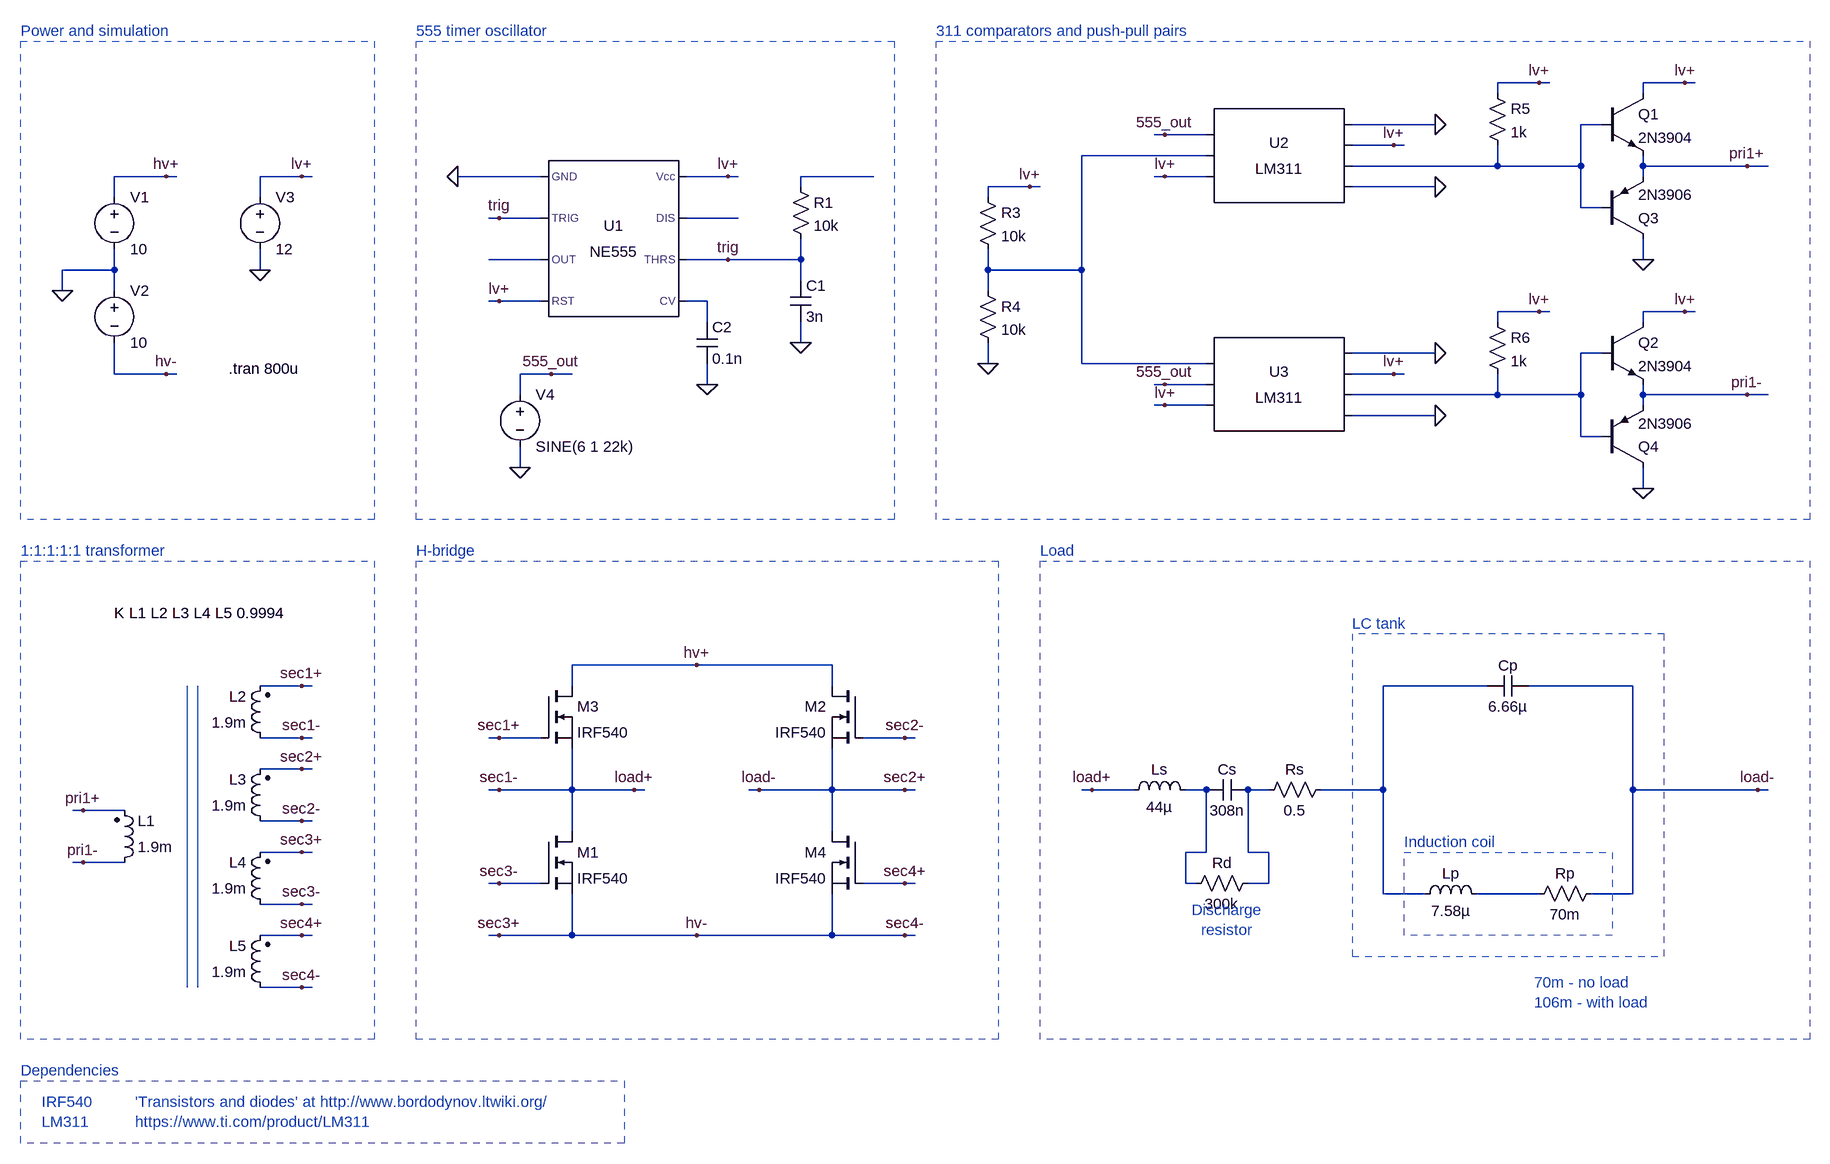
[diagram p0: schematic heater.asc]
heater.asc, the LTspice schematic file:
Version 4
SHEET 1 1956 1544
WIRE 928 -160 864 -160
WIRE 944 -160 928 -160
WIRE 1152 -160 1088 -160
WIRE 1168 -160 1152 -160
WIRE 864 -144 864 -160
WIRE 1088 -144 1088 -160
WIRE 768 -96 640 -96
WIRE 1024 -96 992 -96
WIRE 352 -80 336 -80
WIRE 416 -80 352 -80
WIRE 704 -64 640 -64
WIRE 720 -64 704 -64
WIRE 416 -48 224 -48
WIRE 864 -32 864 -64
WIRE 864 -32 640 -32
WIRE 992 -32 992 -96
WIRE 992 -32 864 -32
WIRE 1088 -32 1088 -48
WIRE 1248 -32 1088 -32
WIRE 1280 -32 1248 -32
WIRE -1184 -16 -1264 -16
WIRE -1168 -16 -1184 -16
WIRE -976 -16 -1040 -16
WIRE -960 -16 -976 -16
WIRE -608 -16 -736 -16
WIRE -320 -16 -384 -16
WIRE -304 -16 -320 -16
WIRE -96 -16 -208 -16
WIRE 352 -16 336 -16
WIRE 416 -16 352 -16
WIRE 1088 -16 1088 -32
WIRE -208 0 -208 -16
WIRE 144 0 80 0
WIRE 160 0 144 0
WIRE 768 0 640 0
WIRE -1264 16 -1264 -16
WIRE -1040 16 -1040 -16
WIRE 80 16 80 0
WIRE 992 32 992 -32
WIRE 1024 32 992 32
WIRE -672 48 -688 48
WIRE -608 48 -672 48
WIRE -304 48 -384 48
WIRE -608 112 -688 112
WIRE -320 112 -384 112
WIRE -208 112 -208 80
WIRE -208 112 -320 112
WIRE 1088 112 1088 80
WIRE -1264 128 -1264 96
WIRE -1264 128 -1344 128
WIRE -1040 128 -1040 96
WIRE 80 128 80 96
WIRE 224 128 224 -48
WIRE 224 128 80 128
WIRE -208 144 -208 112
WIRE -1344 160 -1344 128
WIRE -1264 160 -1264 128
WIRE 80 160 80 128
WIRE -672 176 -688 176
WIRE -608 176 -672 176
WIRE -352 176 -384 176
WIRE 928 192 864 192
WIRE 944 192 928 192
WIRE 1152 192 1088 192
WIRE 1168 192 1152 192
WIRE -352 208 -352 176
WIRE 864 208 864 192
WIRE 1088 208 1088 192
WIRE -208 240 -208 208
WIRE 768 256 640 256
WIRE 1024 256 992 256
WIRE 80 272 80 240
WIRE 224 272 224 128
WIRE 416 272 224 272
WIRE -1264 288 -1264 240
WIRE -1184 288 -1264 288
WIRE -1168 288 -1184 288
WIRE -592 288 -640 288
WIRE -560 288 -592 288
WIRE 704 288 640 288
WIRE 720 288 704 288
WIRE -352 304 -352 272
WIRE 352 304 336 304
WIRE 416 304 352 304
WIRE -640 320 -640 288
WIRE 864 320 864 288
WIRE 864 320 640 320
WIRE 992 320 992 256
WIRE 992 320 864 320
WIRE 1088 320 1088 304
WIRE 1248 320 1088 320
WIRE 1280 320 1248 320
WIRE 352 336 336 336
WIRE 416 336 352 336
WIRE 1088 336 1088 320
WIRE 768 352 640 352
WIRE 992 384 992 320
WIRE 1024 384 992 384
WIRE -640 432 -640 400
WIRE 1088 464 1088 432
WIRE -368 736 -560 736
WIRE -160 736 -368 736
WIRE -976 768 -1040 768
WIRE -960 768 -976 768
WIRE -560 768 -560 736
WIRE -160 768 -160 736
WIRE 848 768 688 768
WIRE 1072 768 912 768
WIRE -976 848 -1040 848
WIRE -960 848 -976 848
WIRE -672 848 -688 848
WIRE -608 848 -672 848
WIRE -48 848 -112 848
WIRE -32 848 -48 848
WIRE -976 896 -1040 896
WIRE -960 896 -976 896
WIRE -672 928 -688 928
WIRE -560 928 -560 864
WIRE -560 928 -672 928
WIRE -464 928 -560 928
WIRE -448 928 -464 928
WIRE -272 928 -288 928
WIRE -160 928 -160 864
WIRE -160 928 -272 928
WIRE -48 928 -160 928
WIRE -32 928 -48 928
WIRE 240 928 224 928
WIRE 304 928 240 928
WIRE 416 928 384 928
WIRE 512 928 480 928
WIRE 688 928 688 768
WIRE 688 928 592 928
WIRE 1072 928 1072 768
WIRE 1264 928 1072 928
WIRE 1280 928 1264 928
WIRE -1312 960 -1328 960
WIRE -1248 960 -1312 960
WIRE -976 976 -1040 976
WIRE -960 976 -976 976
WIRE -560 992 -560 928
WIRE -160 992 -160 928
WIRE -976 1024 -1040 1024
WIRE -960 1024 -976 1024
WIRE 416 1024 416 928
WIRE 416 1024 384 1024
WIRE 480 1024 480 928
WIRE 512 1024 480 1024
WIRE -1312 1040 -1328 1040
WIRE -1248 1040 -1312 1040
WIRE -672 1072 -688 1072
WIRE -608 1072 -672 1072
WIRE -48 1072 -112 1072
WIRE -32 1072 -48 1072
WIRE 384 1072 384 1024
WIRE 400 1072 384 1072
WIRE 512 1072 512 1024
WIRE 512 1072 480 1072
WIRE 688 1088 688 928
WIRE 752 1088 688 1088
WIRE 928 1088 832 1088
WIRE 1072 1088 1072 928
WIRE 1072 1088 1008 1088
WIRE -976 1104 -1040 1104
WIRE -960 1104 -976 1104
WIRE -976 1152 -1040 1152
WIRE -960 1152 -976 1152
WIRE -672 1152 -688 1152
WIRE -560 1152 -560 1088
WIRE -560 1152 -672 1152
WIRE -368 1152 -560 1152
WIRE -160 1152 -160 1088
WIRE -160 1152 -368 1152
WIRE -48 1152 -160 1152
WIRE -32 1152 -48 1152
WIRE -976 1232 -1040 1232
WIRE -960 1232 -976 1232
FLAG -1344 160 0
FLAG -1184 -16 hv+
FLAG -1184 288 hv-
FLAG -736 -16 0
FLAG -208 240 0
FLAG -320 -16 lv+
FLAG -672 176 lv+
FLAG -320 112 trig
FLAG -672 48 trig
FLAG -1040 128 0
FLAG -976 -16 lv+
FLAG 80 272 0
FLAG 144 0 lv+
FLAG 352 304 555_out
FLAG 1248 -32 pri1+
FLAG 1248 320 pri1-
FLAG 768 0 0
FLAG 768 352 0
FLAG 352 -16 lv+
FLAG 928 -160 lv+
FLAG 928 192 lv+
FLAG 1088 464 0
FLAG 1088 112 0
FLAG 1152 -160 lv+
FLAG 1152 192 lv+
FLAG 352 336 lv+
FLAG -672 848 sec1+
FLAG -672 928 sec1-
FLAG -672 1072 sec3-
FLAG -672 1152 sec3+
FLAG -48 848 sec2-
FLAG -48 928 sec2+
FLAG -48 1072 sec4+
FLAG -48 1152 sec4-
FLAG -976 768 sec1+
FLAG -976 848 sec1-
FLAG -976 896 sec2+
FLAG -976 976 sec2-
FLAG -976 1024 sec3+
FLAG -976 1104 sec3-
FLAG -976 1152 sec4+
FLAG -976 1232 sec4-
FLAG -1312 960 pri1+
FLAG -1312 1040 pri1-
FLAG 768 -96 0
FLAG 768 256 0
FLAG -640 432 0
FLAG -352 304 0
FLAG -592 288 555_out
FLAG 704 -64 lv+
FLAG 704 288 lv+
FLAG -464 928 load+
FLAG -272 928 load-
FLAG -368 736 hv+
FLAG -368 1152 hv-
FLAG 240 928 load+
FLAG 1264 928 load-
FLAG 352 -80 555_out
SYMBOL voltage -1264 0 R0
WINDOW 123 0 0 Left 0
WINDOW 39 0 0 Left 0
SYMATTR InstName V1
SYMATTR Value 10
SYMBOL voltage -1264 144 R0
WINDOW 123 0 0 Left 0
WINDOW 39 0 0 Left 0
SYMATTR InstName V2
SYMATTR Value 10
SYMBOL cap -224 144 R0
SYMATTR InstName C1
SYMATTR Value 3n
SYMBOL voltage -1040 0 R0
WINDOW 123 0 0 Left 0
WINDOW 39 0 0 Left 0
SYMATTR InstName V3
SYMATTR Value 12
SYMBOL AutoGenerated\\LM311 528 -48 R0
SYMATTR InstName U2
SYMBOL res 64 0 R0
SYMATTR InstName R3
SYMATTR Value 10k
SYMBOL res 64 144 R0
SYMATTR InstName R4
SYMATTR Value 10k
SYMBOL res 848 -160 R0
SYMATTR InstName R5
SYMATTR Value 1k
SYMBOL AutoGenerated\\LM311 528 304 R0
SYMATTR InstName U3
SYMBOL res 848 192 R0
SYMATTR InstName R6
SYMATTR Value 1k
SYMBOL npn 1024 -144 R0
SYMATTR InstName Q1
SYMATTR Value 2N3904
SYMBOL npn 1024 208 R0
SYMATTR InstName Q2
SYMATTR Value 2N3904
SYMBOL pnp 1024 80 M180
SYMATTR InstName Q3
SYMATTR Value 2N3906
SYMBOL pnp 1024 432 M180
SYMATTR InstName Q4
SYMATTR Value 2N3906
SYMBOL ind2 -1264 1056 M180
WINDOW 0 36 80 Left 2
WINDOW 3 36 40 Left 2
SYMATTR InstName L1
SYMATTR Value 1.9m
SYMATTR Type ind
SYMBOL ind2 -1024 864 R180
WINDOW 0 36 80 Left 2
WINDOW 3 36 40 Left 2
SYMATTR InstName L2
SYMATTR Value 1.9m
SYMATTR Type ind
SYMBOL ind2 -1024 992 R180
WINDOW 0 36 80 Left 2
WINDOW 3 36 40 Left 2
SYMATTR InstName L3
SYMATTR Value 1.9m
SYMATTR Type ind
SYMBOL ind2 -1024 1120 R180
WINDOW 0 36 80 Left 2
WINDOW 3 36 40 Left 2
SYMATTR InstName L4
SYMATTR Value 1.9m
SYMATTR Type ind
SYMBOL ind2 -1024 1248 R180
WINDOW 0 36 80 Left 2
WINDOW 3 36 40 Left 2
SYMATTR InstName L5
SYMATTR Value 1.9m
SYMATTR Type ind
SYMBOL nmos -608 768 R0
SYMATTR InstName M3
SYMATTR Value IRF540
SYMBOL Misc\\NE555 -496 80 R0
SYMATTR InstName U1
SYMBOL voltage -640 304 R0
WINDOW 123 0 0 Left 0
WINDOW 39 0 0 Left 0
SYMATTR InstName V4
SYMATTR Value SINE(6 1 22k)
SYMBOL res -224 -16 R0
SYMATTR InstName R1
SYMATTR Value 10k
SYMBOL cap -368 208 R0
SYMATTR InstName C2
SYMATTR Value 0.1n
SYMBOL nmos -608 992 R0
SYMATTR InstName M1
SYMATTR Value IRF540
SYMBOL nmos -112 768 M0
SYMATTR InstName M2
SYMATTR Value IRF540
SYMBOL nmos -112 992 M0
SYMATTR InstName M4
SYMATTR Value IRF540
SYMBOL ind 288 944 R270
WINDOW 0 32 56 VTop 2
WINDOW 3 5 56 VBottom 2
SYMATTR InstName Ls
SYMATTR Value 44µ
SYMBOL cap 416 944 R270
WINDOW 0 32 32 VTop 2
WINDOW 3 0 32 VBottom 2
SYMATTR InstName Cs
SYMATTR Value 308n
SYMBOL ind 736 1104 R270
WINDOW 0 32 56 VTop 2
WINDOW 3 5 56 VBottom 2
SYMATTR InstName Lp
SYMATTR Value 7.58µ
SYMBOL res 912 1104 R270
WINDOW 0 32 56 VTop 2
WINDOW 3 0 56 VBottom 2
SYMATTR InstName Rp
SYMATTR Value 70m
SYMBOL cap 848 784 R270
WINDOW 0 32 32 VTop 2
WINDOW 3 0 32 VBottom 2
SYMATTR InstName Cp
SYMATTR Value 6.66µ
SYMBOL res 608 912 R90
WINDOW 0 0 56 VBottom 2
WINDOW 3 32 56 VTop 2
SYMATTR InstName Rs
SYMATTR Value 0.5
SYMBOL res 496 1056 R90
WINDOW 0 0 56 VBottom 2
WINDOW 3 32 56 VTop 2
SYMATTR InstName Rd
SYMATTR Value 300k
TEXT -1088 280 Left 2 !.tran 800u
TEXT -1408 -240 Left 2 ;Power and simulation
TEXT -800 -240 Left 2 ;555 timer oscillator
TEXT 0 -240 Left 2 ;311 comparators and push-pull pairs
TEXT -1408 560 Left 2 ;1:1:1:1:1 transformer
TEXT -800 560 Left 2 ;H-bridge
TEXT -1264 656 Left 2 !K L1 L2 L3 L4 L5 0.9994
TEXT -1232 1408 Left 2 ;'Transistors and diodes' at http://www.bordodynov.ltwiki.org/\nhttps://www.ti.com/product/LM311
TEXT -1408 1360 Left 2 ;Dependencies
TEXT -1376 1408 Left 2 ;IRF540\nLM311
TEXT 160 560 Left 2 ;Load
TEXT 720 1008 Left 2 ;Induction coil
TEXT 640 672 Left 2 ;LC tank
TEXT 448 1128 Center 2 ;Discharge\nresistor
TEXT 920 1224 Left 2 ;70m - no load\n106m - with load
LINE Normal -1136 1232 -1136 768
LINE Normal -1152 1232 -1152 768
RECTANGLE Normal -64 512 -800 -224 2
RECTANGLE Normal -864 512 -1408 -224 2
RECTANGLE Normal 1344 512 0 -224 2
RECTANGLE Normal -480 1472 -1408 1376 2
RECTANGLE Normal 1120 688 640 1184 2
RECTANGLE Normal 1040 1152 720 1024 2
RECTANGLE Normal -864 1312 -1408 576 2
RECTANGLE Normal 96 1312 -800 576 2
RECTANGLE Normal 1344 1312 160 576 2

The netlist it stands for:
* heater.asc
V1 hv+ 0 10
V2 0 sec4- 10
C1 trig 0 3n
V3 lv+ 0 12
* U2: LM311 (symbol AutoGenerated\LM311 not available, pins judged from their places): pin1=555_out pin2=N002 pin3=lv+ pin4=0 pin5=lv+ pin6=N001 pin7=0
R3 lv+ N002 10k
R4 N002 0 10k
R5 lv+ N001 1k
* U3: LM311 (symbol AutoGenerated\LM311 not available, pins judged from their places): pin1=N002 pin2=555_out pin3=lv+ pin4=0 pin5=lv+ pin6=N007 pin7=0
R6 lv+ N007 1k
Q1 lv+ N001 pri1+ 0 2N3904
Q2 lv+ N007 pri1- 0 2N3904
Q3 0 N001 pri1+ 0 2N3906
Q4 0 N007 pri1- 0 2N3906
L1 pri1- pri1+ 1.9m
L2 load+ sec1+ 1.9m
L3 sec2- load- 1.9m
L4 sec3- sec4- 1.9m
L5 sec4- sec4+ 1.9m
M3 hv+ sec1+ load+ load+ IRF540
XU1 0 trig N005 lv+ N006 trig N004 lv+ NE555  ; pins GND TRIG OUT RST CV THRS DIS Vcc
V4 555_out 0 SINE(6 1 22k)
R1 N003 trig 10k
C2 N006 0 0.1n
M1 load+ sec3- sec4- sec4- IRF540
M2 hv+ sec2- load- load- IRF540
M4 load- sec4+ sec4- sec4- IRF540
Ls load+ N009 44µ
Cs N009 N010 308n
Lp N008 N011 7.58µ
Rp N011 load- 70m
Cp N008 load- 6.66µ
Rs N008 N010 0.5
Rd N010 N009 300k
.model NPN NPN
.model PNP PNP
.lib standard.bjt
.model NMOS NMOS
.model PMOS PMOS
.lib standard.mos
.tran 800u
* Power and simulation
* 555 timer oscillator
* 311 comparators and push-pull pairs
* 1:1:1:1:1 transformer
* H-bridge
K L1 L2 L3 L4 L5 0.9994
* 'Transistors and diodes' at http://www.bordodynov.ltwiki.org/
* https://www.ti.com/product/LM311
* Dependencies
* IRF540
* LM311
* Load
* Induction coil
* LC tank
* Discharge
* resistor
* 70m - no load
* 106m - with load
.lib NE555.sub
.backanno
.end